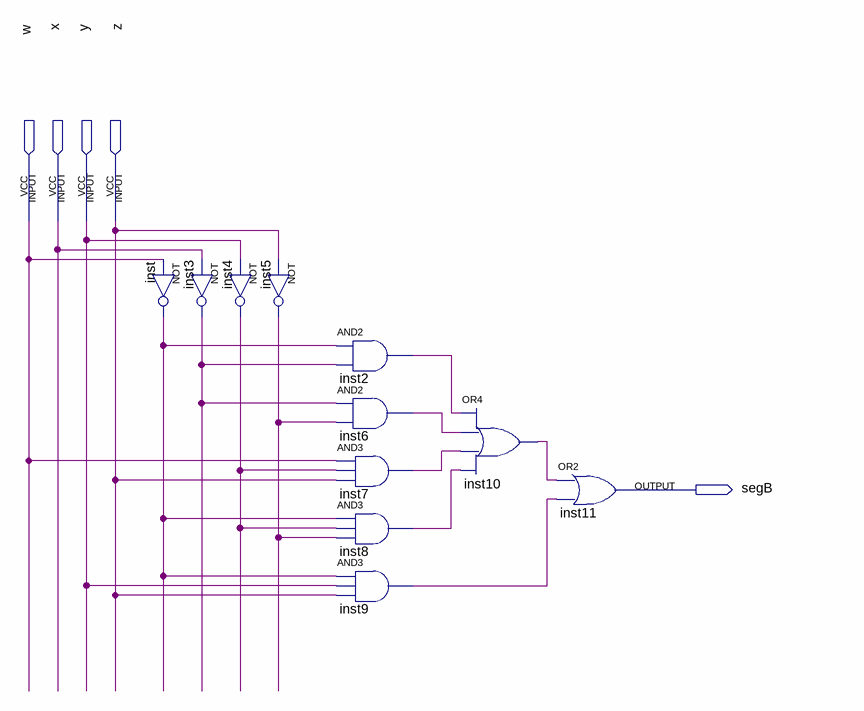
[diagram p0: schematic sheet]
// Quartus schematic segB.bdf as structural Verilog: 11 symbols, 5 pins
module segB (
  input  w,
  input  x,
  input  y,
  input  z,
  output segB
);

  wire inst2_out, inst3_out, inst4_out, inst5_out, inst6_out, inst7_out, inst8_out, inst9_out, inst10_out,
       inst_out;

  not inst (inst_out, w);
  not inst3 (inst3_out, x);
  not inst4 (inst4_out, y);
  not inst5 (inst5_out, z);
  and inst2 (inst2_out, inst_out, inst3_out);
  and inst6 (inst6_out, inst3_out, inst5_out);
  and inst7 (inst7_out, w, inst4_out, z);
  and inst8 (inst8_out, inst_out, inst4_out, inst5_out);
  and inst9 (inst9_out, inst_out, y, z);
  or inst10 (inst10_out, inst2_out, inst6_out, inst7_out, inst8_out);
  or inst11 (segB, inst10_out, inst9_out);
endmodule
